# Altium schematic sheet USB_CONNECTOR.SchDoc
size Letter; SheetNumber: 3; SheetTotal: 5
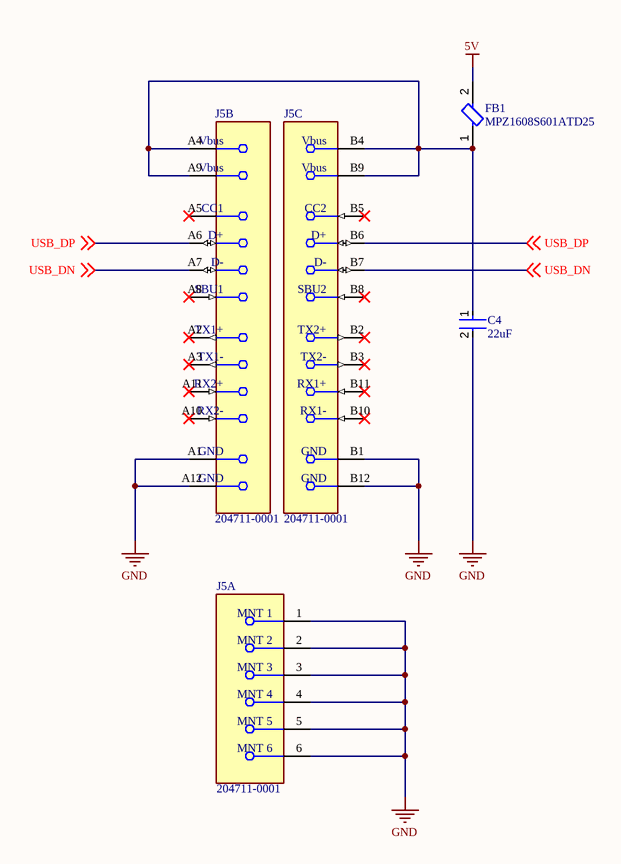
[diagram p0: USB_CONNECTOR.SchDoc]

## Parts
C4  22uF  [FP-CL10-IPC_B]
FB1  MPZ1608S601ATD25  [FP-MPZ1608-0_8-IPC_B]
J5  204711-0001  [FP-204711-0001-MFG]  (parts A,B,C of 3)

## Nets
5V: FB1.2
GND: C4.2 J5.1(MNT_1) J5.2(MNT_2) J5.3(MNT_3) J5.4(MNT_4) J5.5(MNT_5) J5.6(MNT_6) J5.A1(GND) J5.A12(GND) J5.B1(GND) J5.B12(GND)
USB_DN: J5.A7(D-) J5.B7(D-) ; off-sheet USB_DN
USB_DP: J5.A6(D+) J5.B6(D+) ; off-sheet USB_DP
NetC4_1: C4.1 FB1.1 J5.A4(Vbus) J5.A9(Vbus) J5.B4(Vbus) J5.B9(Vbus)

Not connected (* = marked no-connect by the designer): J5 A2(TX1+)* A3(TX1-)* A5(CC1)* A8(SBU1)* A10(RX2-)* A11(RX2+)* B2(TX2+)* B3(TX2-)* B5(CC2)* B8(SBU2)* B10(RX1-)* B11(RX1+)*

## Notes on the sheet
- Title
- Copyright (c) Meta Platforms, Inc. and affiliates.
  All rights reserved.
  This source code is licensed under the license found in the
  LICENSE file in the root directory of this source tree.
- Sheet
- of

## Library data of the parts
C4 = CMP-13271-003290-1: Cap Ceramic 22uF 10V X5R ±20% Pad SMD 0603 +85°C T/R; Max Operating Temperature: 85°C; Packaging: Tape and Reel; Mount: Surface Mount; Width: 0.031inch; Length: 0.063inch; Min Operating Temperature: -55°C; Voltage Rating: 10V; Case/Package: 0603; Thickness: 0.037inch; Case Code (Metric): 1608; Tolerance: 20%; Case Code (Imperial): 0603; Capacitance: 22uF
FB1 = CMP-08257-000403-1: Power line Ferrite Bead 600Ω @ 100MHz 1A DCR 0.15Ω AEC-Q200 SMD 0603; Number of Lines: 1; DC Resistance (DCR): 150mR; Impedance: 600R; Tolerance: 25%; Length: 0.063inch; Max Operating Temperature: 125°C; Lead Free: Lead Free; Min Operating Temperature: -55°C; Test Frequency: 100MHz; Termination: SMD/SMT; Packaging: Tape and Reel; Package Quantity: 4000; Case Code (Metric): 1608; Series: MPZ; Max Current Rating: 1A; Mount: Surface Mount; Max DC Current: 1A; RoHS Compliant: Yes; Case/Package: 0603; Weight: 7.1E-05oz; Ratings: AEC-Q200; Height: 0.037inch; Width: 0.031inch; Case Code (Imperial): 0603
J5 = CMP-04767-000011-1: USB VERTICAL TYPE C 3.1